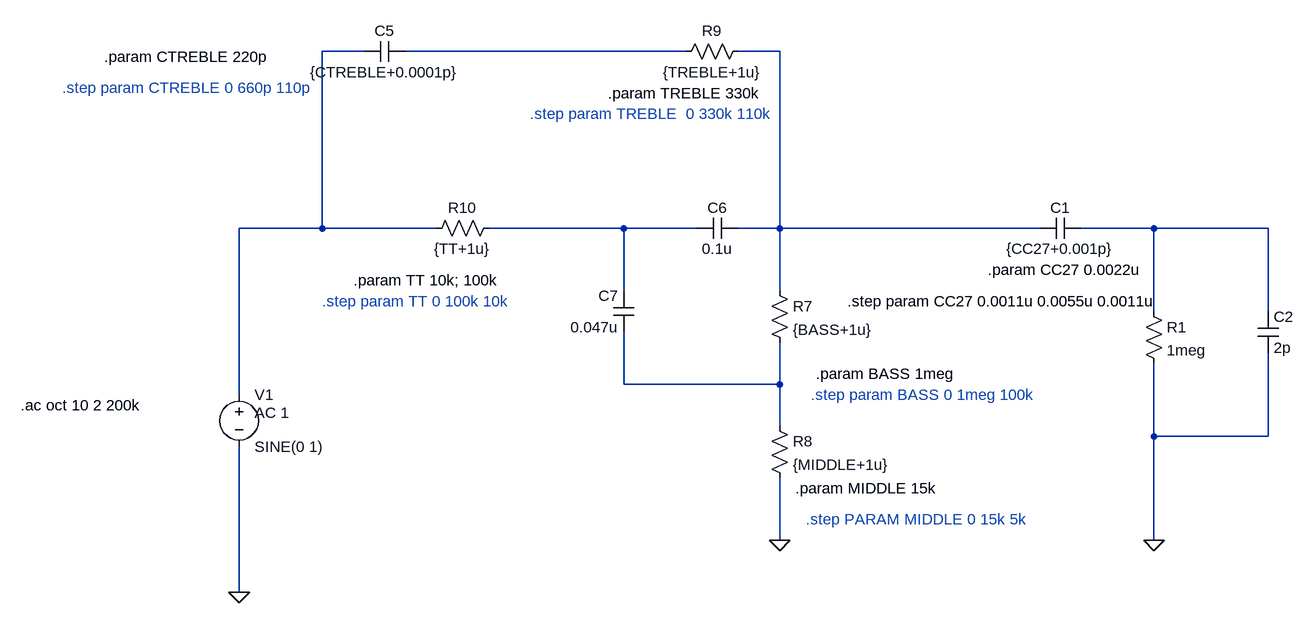
[diagram p0: schematic BD-2.asc]
BD-2.asc, the LTspice schematic file:
Version 4
SHEET 1 956 920
WIRE -480 -640 -544 -640
WIRE 16 -640 -416 -640
WIRE 160 -640 96 -640
WIRE -544 -368 -544 -640
WIRE -544 -368 -672 -368
WIRE -368 -368 -544 -368
WIRE -80 -368 -288 -368
WIRE 32 -368 -80 -368
WIRE 160 -368 160 -640
WIRE 160 -368 96 -368
WIRE 560 -368 160 -368
WIRE 736 -368 624 -368
WIRE 912 -368 736 -368
WIRE -80 -272 -80 -368
WIRE 160 -272 160 -368
WIRE 736 -240 736 -368
WIRE 912 -240 912 -368
WIRE -80 -128 -80 -208
WIRE 160 -128 160 -192
WIRE 160 -128 -80 -128
WIRE -672 -112 -672 -368
WIRE 160 -64 160 -128
WIRE 736 -48 736 -160
WIRE 912 -48 912 -176
WIRE 912 -48 736 -48
WIRE 160 112 160 16
WIRE 736 112 736 -48
WIRE -672 192 -672 -32
FLAG -672 192 0
FLAG 160 112 0
FLAG 736 112 0
SYMBOL voltage -672 -128 R0
WINDOW 123 24 44 Left 2
WINDOW 39 0 0 Left 2
SYMATTR Value2 AC 1
SYMATTR InstName V1
SYMATTR Value SINE(0 1)
SYMBOL res 144 -288 R0
SYMATTR InstName R7
SYMATTR Value {BASS+1u}
SYMBOL res 144 -80 R0
SYMATTR InstName R8
SYMATTR Value {MIDDLE+1u}
SYMBOL res 112 -656 R90
WINDOW 0 0 56 VBottom 2
WINDOW 3 32 56 VTop 2
SYMATTR InstName R9
SYMATTR Value {TREBLE+1u}
SYMBOL res -272 -384 R90
WINDOW 0 0 56 VBottom 2
WINDOW 3 32 56 VTop 2
SYMATTR InstName R10
SYMATTR Value {TT+1u}
SYMBOL cap -416 -656 R90
WINDOW 0 0 32 VBottom 2
WINDOW 3 32 32 VTop 2
SYMATTR InstName C5
SYMATTR Value {CTREBLE+0.0001p}
SYMBOL cap 96 -384 R90
WINDOW 0 0 32 VBottom 2
WINDOW 3 32 32 VTop 2
SYMATTR InstName C6
SYMATTR Value 0.1u
SYMBOL cap -64 -208 R180
WINDOW 0 24 56 Left 2
WINDOW 3 24 8 Left 2
SYMATTR InstName C7
SYMATTR Value 0.047u
SYMBOL cap 624 -384 R90
WINDOW 0 0 32 VBottom 2
WINDOW 3 32 32 VTop 2
SYMATTR InstName C1
SYMATTR Value {CC27+0.001p}
SYMBOL res 720 -256 R0
SYMATTR InstName R1
SYMATTR Value 1meg
SYMBOL cap 896 -240 R0
SYMATTR InstName C2
SYMATTR Value 2p
TEXT -1008 -96 Left 2 !.ac oct 10 2 200k
TEXT 208 -112 Left 2 ;.step param BASS 0 1meg 100k
TEXT 216 -144 Left 2 !.param BASS 1meg
TEXT 184 32 Left 2 !.param MIDDLE 15k
TEXT 200 80 Left 2 ;.step PARAM MIDDLE 0 15k 5k
TEXT -104 -576 Left 2 !.param TREBLE 330k
TEXT -224 -544 Left 2 ;.step param TREBLE  0 330k 110k
TEXT -496 -288 Left 2 !.param TT 10k; 100k
TEXT -544 -256 Left 2 ;.step param TT 0 100k 10k
TEXT -880 -632 Left 2 !.param CTREBLE 220p
TEXT -944 -584 Left 2 ;.step param CTREBLE 0 660p 110p
TEXT 480 -304 Left 2 !.param CC27 0.0022u
TEXT 264 -256 Left 2 !.step param CC27 0.0011u 0.0055u 0.0011u

The netlist it stands for:
* BD-2.asc
V1 N001 0 SINE(0 1) AC 1
R7 N003 N006 {BASS+1u}
R8 N006 0 {MIDDLE+1u}
R9 N003 N002 {TREBLE+1u}
R10 N004 N001 {TT+1u}
C5 N002 N001 {CTREBLE+0.0001p}
C6 N003 N004 0.1u
C7 N006 N004 0.047u
C1 N005 N003 {CC27+0.001p}
R1 N005 0 1meg
C2 N005 0 2p
.ac oct 10 2 200k
* .step param BASS 0 1meg 100k
.param BASS 1meg
.param MIDDLE 15k
* .step PARAM MIDDLE 0 15k 5k
.param TREBLE 330k
* .step param TREBLE  0 330k 110k
.param TT 10k; 100k
* .step param TT 0 100k 10k
.param CTREBLE 220p
* .step param CTREBLE 0 660p 110p
.param CC27 0.0022u
.step param CC27 0.0011u 0.0055u 0.0011u
.backanno
.end